# Altium schematic sheet UControl.SchDoc
size A4
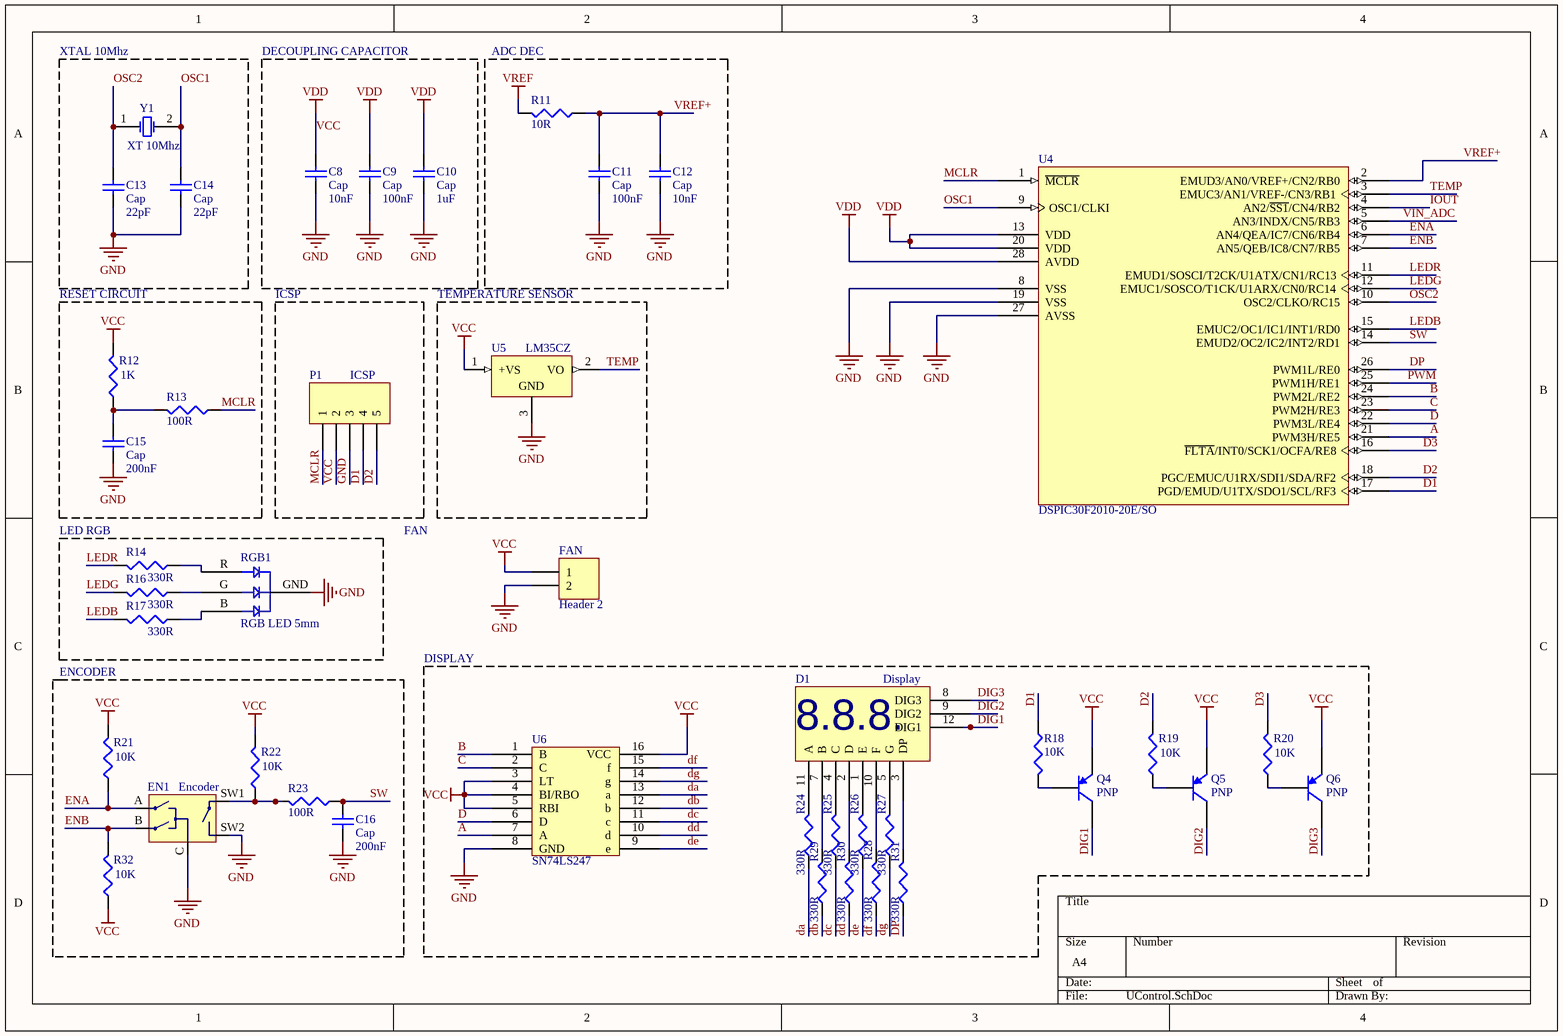
[diagram p0: UControl.SchDoc]

## Parts
C8  Cap  value 10nF  [C0805]
C9  Cap  value 100nF  [C0805]
C10  Cap  value 1uF  [C0805]
C11  Cap  value 100nF  [C0805]
C12  Cap  value 10nF  [C0805]
C13  Cap  value 22pF  [C0805]
C14  Cap  value 22pF  [C0805]
C15  Cap  value 200nF  [C0805]
C16  Cap  value 200nF  [C0805]
D1  Display  [0.36" 7 Segment]
EN1  Encoder  [ENCODER]
FAN  Header 2  [HDR1X2]
P1  ICSP  [HDR1X5]
Q4  PNP  [SOT-23B_N]
Q5  PNP  [SOT-23B_N]
Q6  PNP  [SOT-23B_N]
R11  value 10R  [6-0805_N]  (hidden comment: Res)
R12  value 1K  [6-0805_N]  (hidden comment: Res)
R13  value 100R  [6-0805_N]  (hidden comment: Res)
R14  value 330R  [6-0805_N]  (hidden comment: Res)
R16  value 330R  [6-0805_N]  (hidden comment: Res)
R17  value 330R  [6-0805_N]  (hidden comment: Res)
R18  value 10K  [6-0805_N]  (hidden comment: Res)
R19  value 10K  [6-0805_N]  (hidden comment: Res)
R20  value 10K  [6-0805_N]  (hidden comment: Res)
R21  value 10K  [6-0805_N]  (hidden comment: Res)
R22  value 10K  [6-0805_N]  (hidden comment: Res)
R23  value 100R  [6-0805_N]  (hidden comment: Res)
R24  value 330R  [6-0805_N]  (hidden comment: Res)
R25  value 330R  [6-0805_N]  (hidden comment: Res)
R26  value 330R  [6-0805_N]  (hidden comment: Res)
R27  value 330R  [6-0805_N]  (hidden comment: Res)
R28  value 330R  [6-0805_N]  (hidden comment: Res)
R29  value 330R  [6-0805_N]  (hidden comment: Res)
R30  value 330R  [6-0805_N]  (hidden comment: Res)
R31  value 330R  [6-0805_N]  (hidden comment: Res)
R32  value 10K  [6-0805_N]  (hidden comment: Res)
RGB1  RGB LED 5mm  [LED 5mm tri]
U4  DSPIC30F2010-20E/SO  [SOIC-SO28_N]
U5  LM35CZ  [Z03A]
U6  SN74LS247  [SOIC16-1.27 4mm]
Y1  XT 10Mhz  [HC49/4H_SMX]

## Blocks framed on the sheet
XTAL 10Mhz: C13 C14 Y1
DECOUPLING CAPACITOR: C8-C10
ADC DEC: C11 C12 R11
RESET CIRCUIT: C15 R12 R13
ICSP: P1
TEMPERATURE SENSOR: U5
LED RGB: R14 R16 R17 RGB1
DISPLAY: D1 Q4-Q6 R18-R20 R24-R31 U6
ENCODER: C16 EN1 R21-R23 R32

## Nets
GND: C8.1 C9.1 C10.1 C11.1 C12.1 C13.1 C14.1 C15.1 C16.1 EN1.C EN1.SW2 FAN.2 P1.3 RGB1.GND U4.8(VSS) U4.19(VSS) U4.27(AVSS) U5.3(GND) U6.8(GND)
VCC: C8.2 C9.2 C10.2 FAN.1 P1.2 Q4.2(E) Q5.2(E) Q6.2(E) R12.2 R21.2 R22.2 R32.1 U4.13(VDD) U4.20(VDD) U4.28(AVDD) U5.1(+VS) U6.3(LT) U6.4(BI/RBO) U6.5(RBI) U6.16(VCC)  [also labelled VDD]
VREF: R11.2
A: U4.21(PWM3H/RE5) U6.7(A)
B: U4.24(PWM2L/RE2) U6.1(B)
C: U4.23(PWM2H/RE3) U6.2(C)
D: U4.22(PWM3L/RE4) U6.6(D)
D1: P1.4 R18.1 U4.17(PGD/EMUD/U1TX/SDO1/SCL/RF3)
D2: P1.5 R19.2 U4.18(PGC/EMUC/U1RX/SDI1/SDA/RF2)
D3: R20.2 U4.16(~{FLTA}/INT0/SCK1/OCFA/RE8)
da: R24.1 U6.13(a)
db: R29.1 U6.12(b)
dc: R25.1 U6.11(c)
dd: R30.1 U6.10(d)
de: R26.1 U6.9(e)
df: R28.1 U6.15(f)
dg: R27.1 U6.14(g)
DIG1: D1.12(DIG1) Q4.3(C)
DIG2: D1.9(DIG2) Q5.3(C)
DIG3: D1.8(DIG3) Q6.3(C)
DP: R31.1 U4.26(PWM1L/RE0)
ENA: EN1.A R21.1 U4.6(AN4/QEA/IC7/CN6/RB4)
ENB: EN1.B R32.2 U4.7(AN5/QEB/IC8/CN7/RB5)
IOUT: U4.4(AN2/~{SS1}/CN4/RB2)
LEDB: R17.2 U4.15(EMUC2/OC1/IC1/INT1/RD0)
LEDG: R16.2 U4.12(EMUC1/SOSCO/T1CK/U1ARX/CN0/RC14)
LEDR: R14.2 U4.11(EMUD1/SOSCI/T2CK/U1ATX/CN1/RC13)
MCLR: P1.1 R13.1 U4.1(~{MCLR})
OSC1: C14.2 U4.9(OSC1/CLKI) Y1.2(OSC2)
OSC2: C13.2 U4.10(OSC2/CLKO/RC15) Y1.1(OSC1)
PWM: U4.25(PWM1H/RE1)
SW: C16.2 R23.1 U4.14(EMUD2/OC2/IC2/INT2/RD1)
TEMP: U4.3(EMUC3/AN1/VREF-/CN3/RB1) U5.2(VO)
VIN_ADC: U4.5(AN3/INDX/CN5/RB3)
VREF+: C11.2 C12.2 R11.1 U4.2(EMUD3/AN0/VREF+/CN2/RB0)
NetC15_2: C15.2 R12.1 R13.2
NetD1_1: D1.1(E) R26.2
NetD1_2: D1.2(D) R30.2
NetD1_3: D1.3(DP) R31.2
NetD1_4: D1.4(C) R25.2
NetD1_5: D1.5(G) R27.2
NetD1_7: D1.7(B) R29.2
NetD1_10: D1.10(F) R28.2
NetD1_11: D1.11(A) R24.2
NetEN1_SW1: EN1.SW1 R22.1 R23.2
NetQ4_1: Q4.1(B) R18.2
NetQ5_1: Q5.1(B) R19.1
NetQ6_1: Q6.1(B) R20.1
NetR14_1: R14.1 RGB1.R
NetR16_1: R16.1 RGB1.G
NetR17_1: R17.1 RGB1.B

## Notes on the sheet
- FAN
- (in symbol 0.36" 7 Segment Display 3 Digit Common Anode) 8.8.8.

## Library data of the parts
C8-C16 = Cap: Capacitor; Published: 8-Jun-2000; LatestRevisionDate: 17-Jul-2002; LatestRevisionNote: Re-released for DXP Platform.; PackageReference: RAD-0.3; Publisher: Altium Limited; PackageDescription: Radial Cap, Thru-Hole; 2 Leads; 0.3 in Pin Spacing
D1 = 0.36" 7 Segment Display 3 Digit Common Anode
FAN = Header 2: Header, 2-Pin; LatestRevisionDate: 17-Jul-2002; LatestRevisionNote: Re-released for DXP Platform.; Publisher: Altium Limited
P1 = Header 5: Header, 5-Pin; LatestRevisionDate: 17-Jul-2002; LatestRevisionNote: Re-released for DXP Platform.; Publisher: Altium Limited
Q4-Q6 = PNP: PNP Bipolar Transistor; Published: 8-Jun-2000; LatestRevisionDate: 29-May-2009; LatestRevisionNote: IPC-7351 Footprint Added.; PackageVersion: Aug-1999; PackageReference: SOT-23B; Publisher: Altium Limited; PackageDescription: 3-Pin SOT-23 Package 0.95 mm Pitch, 2.4 mm Lead Span
R11-R14 R16-R32 = Res3: Resistor; Published: 8-Jun-2000; LatestRevisionDate: 29-May-2009; LatestRevisionNote: IPC-7351 Footprint Added.; PackageReference: J1-0603; Publisher: Altium Limited; PackageDescription: Chip Resistor
U4 = DSPIC30F2010-20E/SO: High-Performance 16-bit Digital Signal Controller, 12 KB Flash, 512 Byte SRAM, 1 KB EEPROM, 28-Pin SOIC, Extended High Temperature; Published: 29-Jan-2009; DatasheetVersion: revH, May-2008; PackageVersion: revBB, Aug-2009; PackageReference: SOIC-SO28; Publisher: Altium Limited; PackageDescription: 28-Lead Plastic Small Outline (SO) - Wide 7.50mm Body [SOIC]; Supplier 1: Digi-Key; Supplier Part Number 1: DSPIC30F2010-20E/SO-ND; Code_JEDEC: MS-013; ComponentLink1Description: Datasheet; ComponentLink1URL: http://ww1.microchip.com/downloads/en/DeviceDoc/70118H.pdf; ComponentLink2Description: Packaging Specification; ComponentLink2URL: http://www.microchip.com/stellent/groups/techpub_sg/documents/packagingspec/en012702.pdf; ComponentLink3Description: Microchip.com Home; ComponentLink3URL: http://www.microchip.com/
U5 = LM35CZ: Precision Centigrade Temperature Sensor, 3-pin TO-92; Manufacturer: National Semiconductor; PackageTopMarking: NSXYTT*LM35*CZ; PowerWise: N; CompType: Temp Sensor IC; High-Reliability: Y; DatasheetVersion: Nov-2000; PackageVersion: revG, Sep-2000; PackageReference: Z03A; PackageDescription: TO-92, Molded, 3 Lead; PartNumber: LM35CZ; RoHS: N; PinCount: 3; Code_JEDEC: TO-226-AA; ComponentLink1Description: Manufacturer URL; ComponentLink1URL: http://www.national.com/; ComponentLink2Description: LM35 Datasheet; ComponentLink2URL: http://www.national.com/ds/LM/LM35.pdf; ComponentLink3Description: LM35 Web Page; ComponentLink3URL: http://www.national.com/pf/LM/LM35.html; ComponentLink4Description: Z03A Package Page; ComponentLink4URL: http://www.national.com/packaging/folders/z03a.html
Y1 = HC49/4H_SMX: Surface Mount Quartz Crystal; Note: PCB layout complies with manufacturer's recommendation.; Published: 17-Jul-2002; DatasheetDocument: 18-Oct-1999; PackageDocument: 18-Oct-1999; PackageReference: HC49/4H_SMX; Publisher: Altium Limited; ComponentLink1Description: Manufacturer Link; ComponentLink1URL: http://www.cmac.com/mt/; ComponentLink2Description: Datasheet; ComponentLink2URL: http://www.cmac.com/mt/databook/crystals/smd/hc49_4h_smx.pdf